# EAGLE design main_v2.0 (EAGLE 7.2.0)
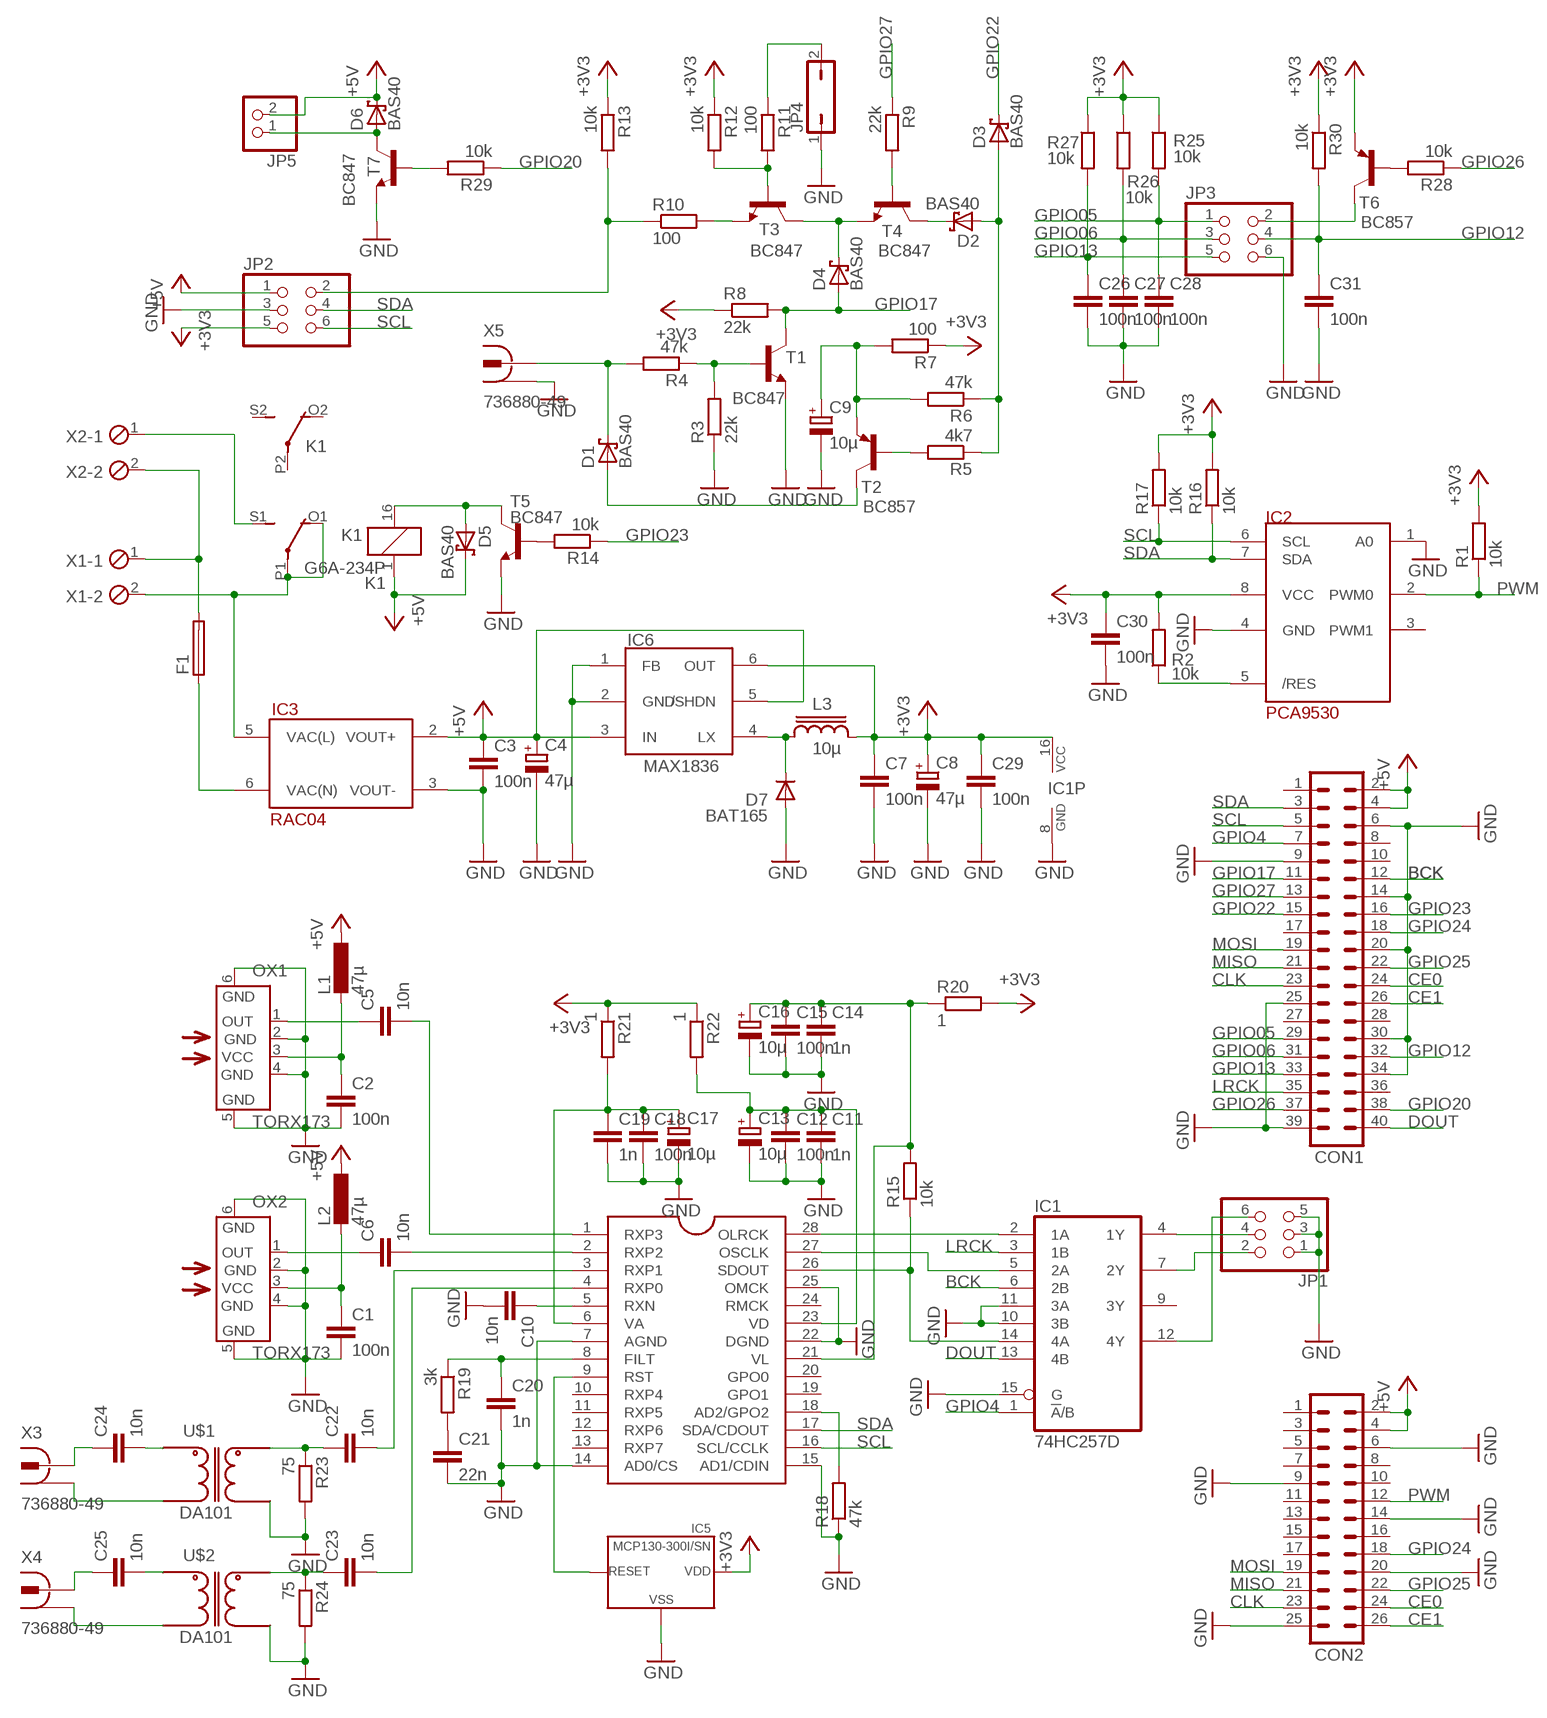
[diagram p0: schematic, sheet 1]

## Parts
C1  100n  C-EUC0805  [C0805]
C2  100n  C-EUC0805  [C0805]
C3  100n  C-EUC0805  [C0805]
C4  47µ  CPOL-EUCT3528  [CT3528]
C5  10n  C-EUC0805  [C0805]
C6  10n  C-EUC0805  [C0805]
C7  100n  C-EUC0805  [C0805]
C8  47µ  CPOL-EUCT3528  [CT3528]
C9  10µ  CPOL-EUCT3216  [CT3216]
C10  10n  C-EUC0805  [C0805]
C11  1n  C-EUC0805  [C0805]
C12  100n  C-EUC0805  [C0805]
C13  10µ  CPOL-EUCT3216  [CT3216]
C14  1n  C-EUC0805  [C0805]
C15  100n  C-EUC0805  [C0805]
C16  10µ  CPOL-EUCT3216  [CT3216]
C17  10µ  CPOL-EUCT3216  [CT3216]
C18  100n  C-EUC0805  [C0805]
C19  1n  C-EUC0805  [C0805]
C20  1n  C-EUC0805  [C0805]
C21  22n  C-EUC0805  [C0805]
C22  10n  C-EUC0805  [C0805]
C23  10n  C-EUC0805  [C0805]
C24  10n  C-EUC0805  [C0805]
C25  10n  C-EUC0805  [C0805]
C26  100n  C-EUC0805  [C0805]
C27  100n  C-EUC0805  [C0805]
C28  100n  C-EUC0805  [C0805]
C29  100n  C-EUC0805  [C0805]
C30  100n  C-EUC0805  [C0805]
C31  100n  C-EUC0805  [C0805]
CON1  MA20-2  [MA20-2]
CON2  MA13-2  [MA13-2]
D1  BAS40  [SOT23]
D2  BAS40  [SOT23]
D3  BAS40  [SOT23]
D4  BAS40  [SOT23]
D5  BAS40  [SOT23]
D6  BAS40  [SOT23]
D7  BAT165  DIODE-SOD-323  [SOD-323F]
F1  19560  [19560]
IC1  74HC257D  [SO16]
IC2  PCA9530  [SOIC-8]
IC3  RAC04  [RECOM-RAC04]
IC4  CS8416  CS8416-SOFTWAREMODESOFTWAREMODE  [SO28L]
IC5  MCP130-300I/SN  [SOT-23]
IC6  MAX1836  MAX1836SOT23  [SOT23-6L]
JP1  PINHD-2X3  [2X03]
JP2  PINHD-2X3  [2X03]
JP3  PINHD-2X3  [2X03]
JP4  JP1Q  [JP1]
JP5  PINHD-1X2  [1X02]
K1  G6A-234P  [G6A-234P]
L1  47µ  L-EU  [C1210]
L2  47µ  L-EU  [C1210]
L3  10µ  LPS4018  [LPS4018]
OX1  TORX173  [TORX173]
OX2  TORX173  [TORX173]
R1  10k  R-EU_R0805  [R0805]
R2  10k  R-EU_R0805  [R0805]
R3  22k  R-EU_R0805  [R0805]
R4  47k  R-EU_R0805  [R0805]
R5  4k7  R-EU_R0805  [R0805]
R6  47k  R-EU_R0805  [R0805]
R7  100  R-EU_R0805  [R0805]
R8  22k  R-EU_R0805  [R0805]
R9  22k  R-EU_R0805  [R0805]
R10  100  R-EU_R0805  [R0805]
R11  100  R-EU_R0805  [R0805]
R12  10k  R-EU_R0805  [R0805]
R13  10k  R-EU_R0805  [R0805]
R14  10k  R-EU_R0805  [R0805]
R15  10k  R-EU_R0805  [R0805]
R16  10k  R-EU_R0805  [R0805]
R17  10k  R-EU_R0805  [R0805]
R18  47k  R-EU_R0805  [R0805]
R19  3k  R-EU_R0805  [R0805]
R20  1  R-EU_R0805  [R0805]
R21  1  R-EU_R0805  [R0805]
R22  1  R-EU_R0805  [R0805]
R23  75  R-EU_R0805  [R0805]
R24  75  R-EU_R0805  [R0805]
R25  10k  R-EU_R0805  [R0805]
R26  10k  R-EU_R0805  [R0805]
R27  10k  R-EU_R0805  [R0805]
R28  10k  R-EU_R0805  [R0805]
R29  10k  R-EU_R0805  [R0805]
R30  10k  R-EU_R0805  [R0805]
T1  BC847  BC847-NPN-SOT23-BEC  [SOT23-BEC]
T2  BC857  BC857A-PNP-SOT23-BEC  [SOT23-BEC]
T3  BC847  BC847-NPN-SOT23-BEC  [SOT23-BEC]
T4  BC847  BC847-NPN-SOT23-BEC  [SOT23-BEC]
T5  BC847  BC847-NPN-SOT23-BEC  [SOT23-BEC]
T6  BC857  BC857A-PNP-SOT23-BEC  [SOT23-BEC]
T7  BC847  BC847-NPN-SOT23-BEC  [SOT23-BEC]
U$1  DA101  [6PIN-DIL]
U$2  DA101  [6PIN-DIL]
X1  2POL500  [2POL500]
X2  2POL500  [2POL500]
X3  736880-49  [736880-49]
X4  736880-49  [736880-49]
X5  736880-49  [736880-49]

## Nets
+3V3: C7.1 C8.+ C29.1 C30.1 IC1.16(VCC) IC2.8(VCC) IC5.2(VDD) IC6.6(OUT) JP2.5 L3.2 R1.2 R2.2 R7.1 R8.1 R12.1 R13.1 R16.2 R17.2 R20.2 R21.1 R22.1 R25.1 R26.1 R27.1 R30.1 T6.E
+5V: C3.1 C4.+ CON1.2 CON1.4 CON2.2 CON2.4 D5.3(C) D6.3(C) IC3.2(VOUT+) IC6.3(IN) IC6.5(/SHDN) JP2.1 JP5.2 K1.1 L1.1 L2.1
BCK: CON1.12 IC1.6(2B)
CE0: CON1.24 CON2.24
CE1: CON1.26 CON2.26
CLK: CON1.23 CON2.23
DOUT: CON1.40 IC1.13(4B)
GND: C1.2 C2.2 C3.2 C4.- C7.2 C8.- C9.- C10.2 C11.2 C12.2 C13.- C14.2 C15.2 C16.- C17.- C18.2 C19.2 C20.2 C21.2 C26.2 C27.2 C28.2 C29.2 C30.2 C31.2 CON1.6 CON1.9 CON1.14 CON1.20 CON1.25 CON1.30 CON1.34 CON1.39 CON2.6 CON2.9 CON2.14 CON2.20 CON2.25 D7.A IC1.8(GND) IC1.10(3B) IC1.11(3A) IC1.15(G) IC2.1(A0) IC2.4(GND) IC3.3(VOUT-) IC4.7(AGND) IC4.14(AD0/CS) IC4.15(AD1/CDIN) IC4.22(DGND) IC4.25(OMCK) IC5.3(VSS) IC6.1(FB) IC6.2(GND) JP1.1 JP1.3 JP1.5 JP2.3 JP3.6 JP4.1 OX1.2(GND) OX1.4(GND) OX1.5(GND) OX1.6(GND) OX2.2(GND) OX2.4(GND) OX2.5(GND) OX2.6(GND) R3.1 R18.1 R23.2 R24.2 T1.E T5.E T7.E U$1.4 U$2.4 X5.1 X5.1@1 X5.1@2
GPIO4: CON1.7 IC1.1(!A!/B)
GPIO05: C28.1 CON1.29 JP3.1 R25.2
GPIO06: C27.1 CON1.31 JP3.3 R26.2
GPIO12: C31.1 CON1.32 JP3.4 R30.2
GPIO13: C26.1 CON1.33 JP3.5 R27.2
GPIO17: CON1.11 D4.1(A) R8.2 T1.C
GPIO20: CON1.38 R29.1
GPIO22: CON1.15 D3.3(C)
GPIO23: CON1.16 R14.1
GPIO24: CON1.18 CON2.18
GPIO25: CON1.22 CON2.22
GPIO26: CON1.37 R28.1
GPIO27: CON1.13 R9.1
LRCK: CON1.35 IC1.3(1B)
MISO: CON1.21 CON2.21
MOSI: CON1.19 CON2.19
N$1: C11.1 C12.1 C13.+ IC4.23(VD) R22.2
N$2: IC1.2(1A) IC4.28(OLRCK)
N$3: IC1.5(2A) IC4.27(OSCLK)
N$4: IC1.14(4A) IC4.26(SDOUT) R15.1
N$5: IC4.9(RST) IC5.1(RESET)
N$6: IC2.5(/RES) R2.1
N$7: F1.1 IC3.6(VAC(N))
N$8: C17.+ C18.1 C19.1 IC4.6(VA) R21.2
N$9: C6.1 OX2.1(OUT)
N$10: C5.1 OX1.1(OUT)
N$11: C6.2 IC4.2(RXP2)
N$12: C5.2 IC4.1(RXP3)
N$13: IC3.5(VAC(L)) K1.O1(2:O) K1.P1(2:P) X1.2
N$14: R3.2 R4.1 T1.B
N$15: JP4.2 R11.1
N$16: D1.1(A) T2.C
N$17: D1.3(C) R4.2 X5.2
N$18: C9.+ R6.2 R7.2 T2.E
N$19: R5.2 T2.B
N$20: D2.1(A) D3.1(A) R5.1 R6.1
N$21: D4.3(C) T3.C T4.E
N$22: R10.2 T3.E
N$23: R11.2 R12.2 T3.B
N$24: R9.2 T4.B
N$25: D2.3(C) T4.C
N$26: IC1.7(2Y) JP1.2
N$27: IC1.4(1Y) JP1.4
N$28: D7.C IC6.4(LX) L3.1
N$29: JP2.2 R10.1 R13.2
N$30: C10.1 IC4.5(RXN)
N$31: IC4.18(AD2/GPO2) R18.2
N$32: C14.1 C15.1 C16.+ IC4.21(VL) R15.2 R20.1
N$33: D5.1(A) K1.16 T5.C
N$34: R14.2 T5.B
N$35: C22.1 R23.1 U$1.6
N$36: C20.1 IC4.8(FILT) R19.1
N$37: C21.1 R19.2
N$38: C22.2 IC4.3(RXP1)
N$39: C23.2 IC4.4(RXP0)
N$40: C23.1 R24.1 U$2.6
N$41: C24.2 U$1.1
N$42: U$1.3 X3.1 X3.1@1 X3.1@2
N$43: C24.1 X3.2
N$44: C25.2 U$2.1
N$45: U$2.3 X4.1 X4.1@1 X4.1@2
N$46: C25.1 X4.2
N$47: R28.2 T6.B
N$48: K1.S1(2:S) X2.1
N$49: F1.2 X1.1 X2.2
N$50: C2.1 L1.2 OX1.3(VCC)
N$51: C1.1 L2.2 OX2.3(VCC)
N$52: D6.1(A) JP5.1 T7.C
N$53: IC1.12(4Y) JP1.6
N$54: JP3.2 T6.C
N$55: R29.2 T7.B
PWM: CON2.12 IC2.2(PWM0) R1.1
SCL: CON1.5 IC2.6(SCL) IC4.16(SCL/CCLK) JP2.6 R17.1
SDA: CON1.3 IC2.7(SDA) IC4.17(SDA/CDOUT) JP2.4 R16.1
Unconnected: CON1.1 CON1.8 CON1.10 CON1.17 CON1.27 CON1.28 CON1.36 CON2.1 CON2.3 CON2.5 CON2.7 CON2.8 CON2.10 CON2.11 CON2.13 CON2.15 CON2.16 CON2.17 IC1.9(3Y) IC2.3(PWM1) IC4.10(RXP4) IC4.11(RXP5) IC4.12(RXP6) IC4.13(RXP7) IC4.19(GPO1) IC4.20(GPO0) IC4.24(RMCK) K1.O2(3:O) K1.P2(3:P) K1.S2(3:S)

## Library data of the parts
C1-C3 C5-C7 C10-C12 C14 C15 C18-C31 = rcl:C-EU: CAPACITOR, European symbol
C4 C8 C9 C13 C16 C17 = rcl:CPOL-EU: POLARIZED CAPACITOR, European symbol
CON1 = con-lstb:MA20-2: PIN HEADER; OC_FARNELL: unknown; OC_NEWARK: unknown
CON2 = con-lstb:MA13-2: PIN HEADER; OC_FARNELL: unknown; OC_NEWARK: unknown
D1-D6 = diode:BAS40: Silicon Schottky Diodes General-purpose diode for high-speed switching
D7 = dp_devices:DIODE: Various Diode Packages
F1 = fuse:19560: FUSE HOLDER TR5, Wickmann; MPN: 56000001009; OC_FARNELL: 1185363; OC_NEWARK: 15P8392
IC1 = 74xx-eu:74*257: Quadruple 2-to 1 line data SELECTOR/MULTIPLEXER
IC2 = user:PCA9530
IC3 = user:RAC04
IC4 = cirrus-dar:CS8416-SOFTWAREMODE: 24bit 192kHz Digital Audio Interface Receiver - Software Mode
IC5 = microchip_mcp130:MCP130
IC6 = maxim-5:MAX1836
JP1-JP3 = pinhead:PINHD-2X3: PIN HEADER
JP4 = jumper:JP1Q: JUMPER
JP5 = pinhead:PINHD-1X2: PIN HEADER
K1 = relay:G6A-234P: RELAY 2 x switch, 0.3 A/125 V AC, 1 A/30 V DC, Omron; OC_FARNELL: unknown; OC_NEWARK: unknown
L1 L2 = user:L-EU: INDUCTOR, European symbol
L3 = inductor-coilcraft:LPS4018: POWER INDUCTOR
OX1 OX2 = toshiba:TORX173: FIBER OPTIC RECEIVING MODULE FOR DIGITAL AUDIO EQUIPMENT, TTL Interface TORX173.pdf; OC_FARNELL: unknown; OC_NEWARK: unknown
R1-R30 = rcl:R-EU_: RESISTOR, European symbol
T1 T3-T5 T7 = transistor:*-NPN-: NPN Transistror BF959 corrected 2008.03.06
T2 T6 = transistor:*-PNP-: PNP Transistror
U$1 U$2 = user:DA101
X1 X2 = user:2POL500: PHOENIX CONNECTOR; OC_FARNELL: unknown; OC_NEWARK: unknown
X3-X5 = con-conrad:736880-49: Cinch Connector ( RCA Jack ) Cinch-Einbaukupplung 90º 72345 Vernickelt BKL Electronic Source: Conrad <http://www.conrad.de/ce/de/product/736880>

## Board
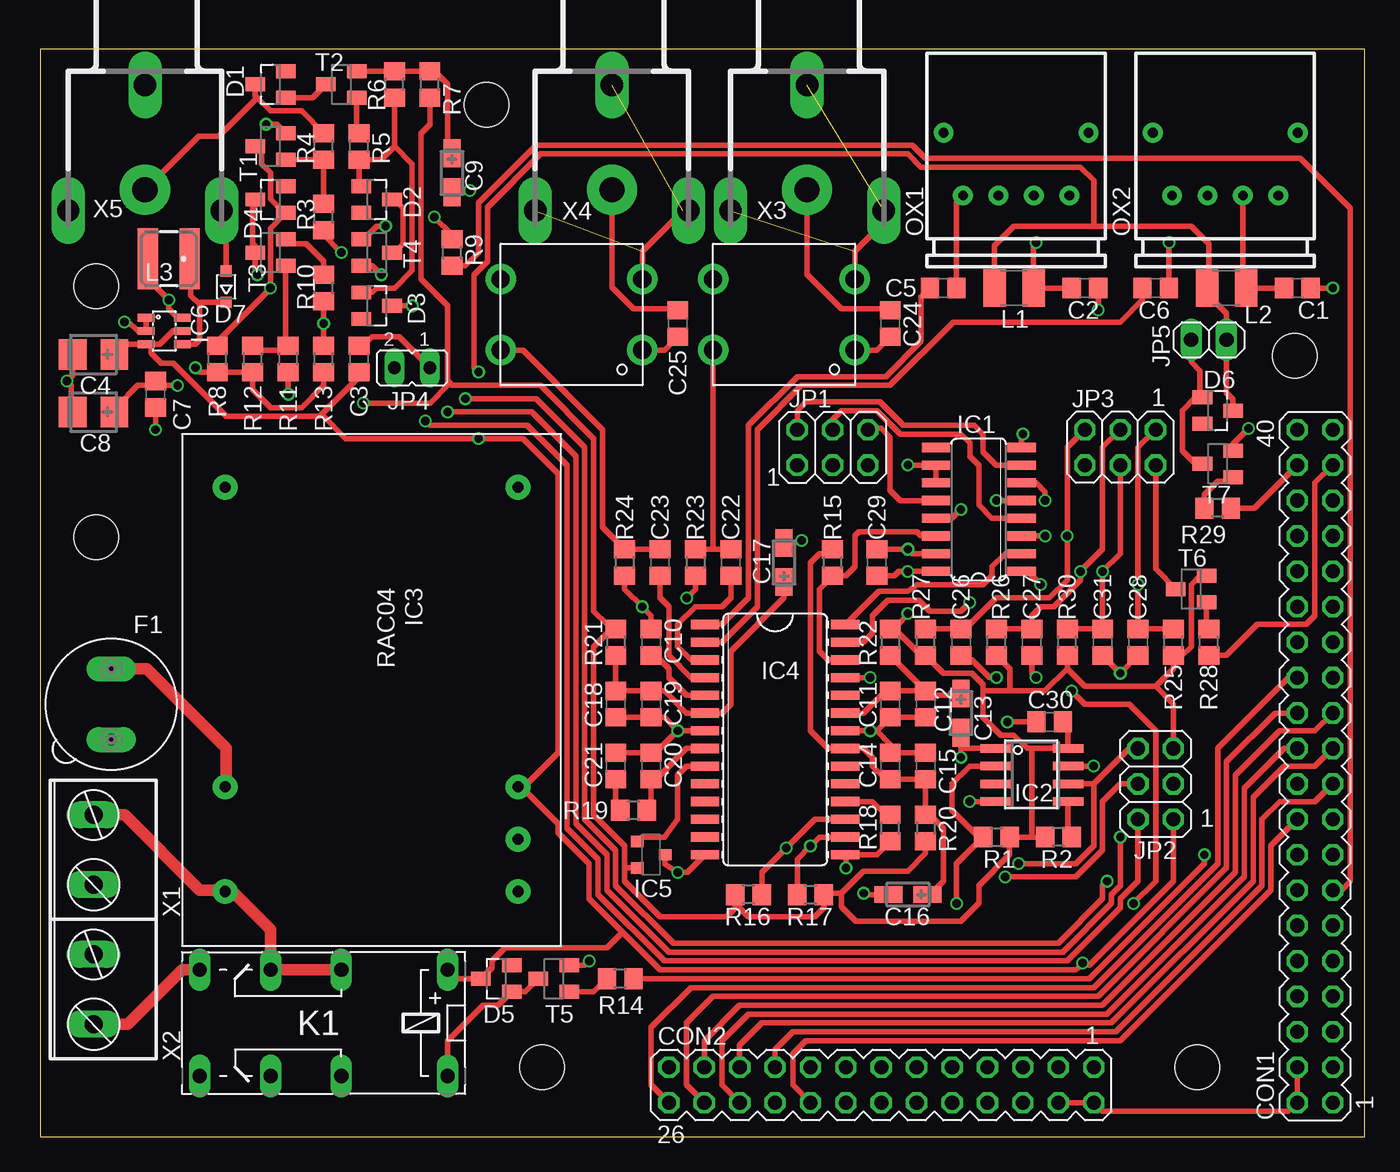
[diagram p1: board, top side]
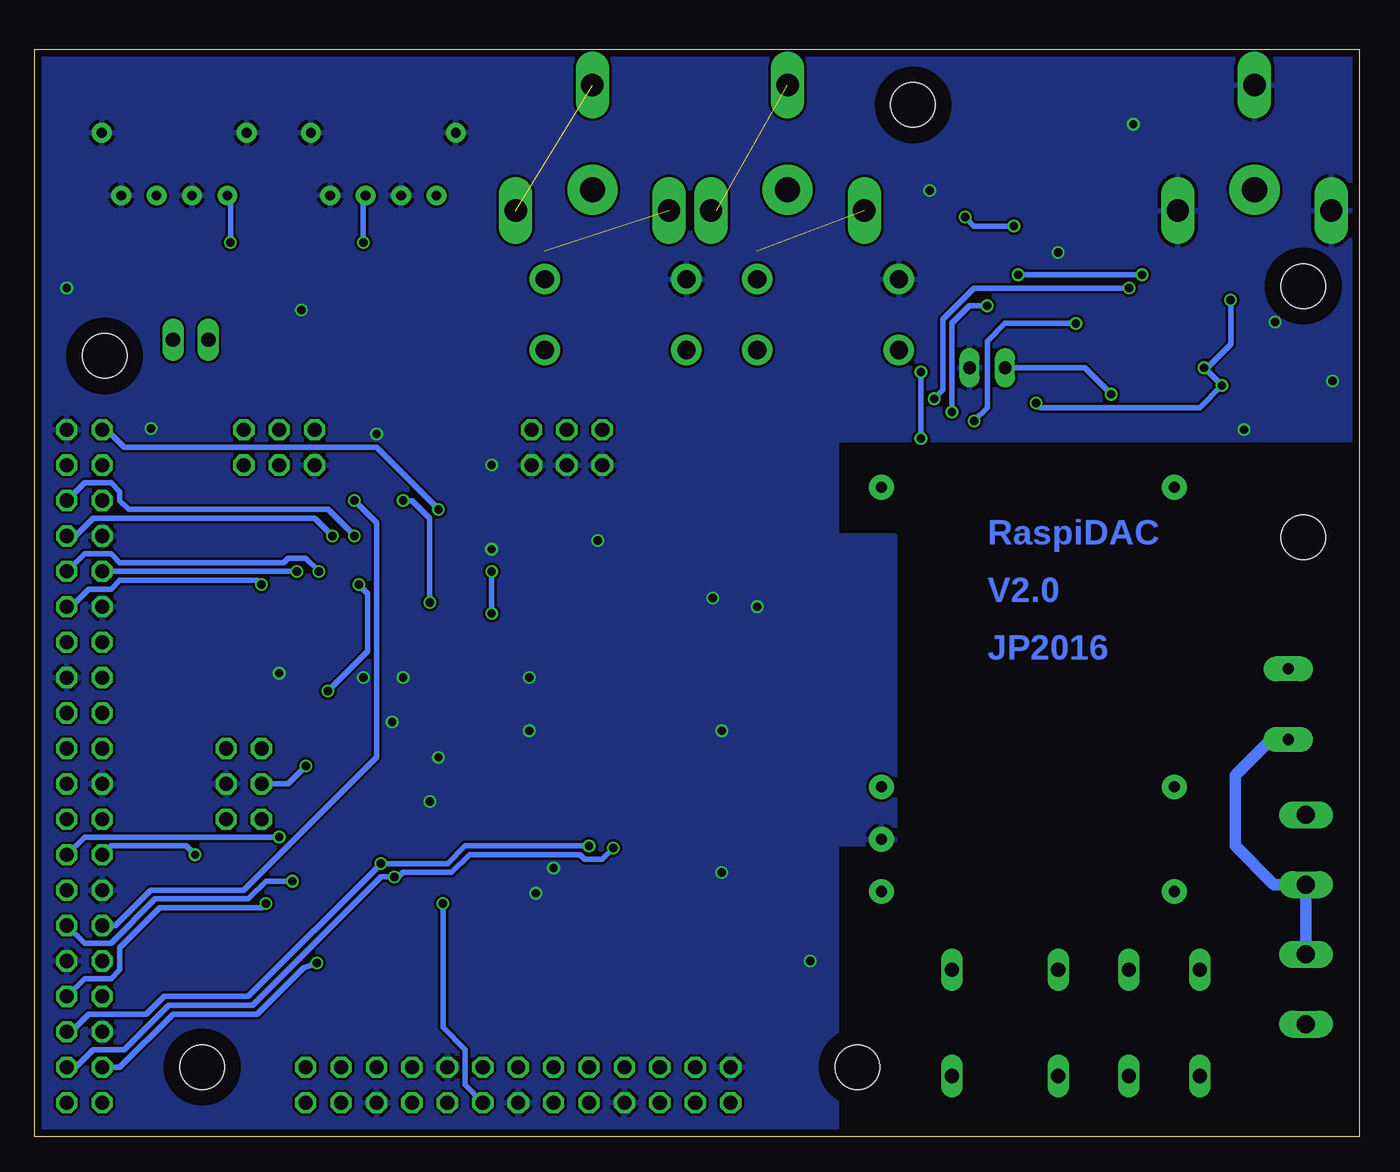
[diagram p2: board, bottom side, seen from below]

Size 95 x 78 mm. Coordinates in mm from the lower left corner, seen from the top.
Outline: 0,0 95,0 95,78 0,78 0,0
Copper layers (1*16): Top 0.035mm / dielectric 1.5mm / Bottom 0.035mm
Design rules "EagleRules *": minimum track width 7mil, minimum drill 12mil, track to track 7mil, track to pad 7mil, pad to pad 7mil, via to via 7mil, smd to smd 0mil, copper to edge 20mil, drill to drill 10mil, minimum pad ring 10mil, minimum via ring 6mil, stop-mask expansion 2mil, vias tented up to drill 25mil, thermal gap 10mil
Holes 3.2 mm at 36,5 32,74 90,56 83,5 4,61 4,43
bRestrict: area 29.2,71.2 to 34.8,76.8; area 87.2,53.2 to 92.8,58.8; area 80.2,2.2 to 85.8,7.8; area 33.2,2.2 to 38.8,7.8; area 1.2,58.2 to 6.8,63.8; area 1.2,40.2 to 6.8,45.8

### Footprints (pad centres in the part's own frame; a part is rotated, then mirrored left to right if it is on the bottom)
C0805 = smd 1.3 x 1.5: 1 -0.95,0; 2 0.95,0
CT3528 = smd 2 x 2.2: + -1.5,0; - 1.5,0
CT3216 = smd 2 x 1.2: + -1.4,0; - 1.4,0
MA20-2 = drill 1.016 octagon: 1 -24.13,-1.27; 2 -24.13,1.27; 3 -21.59,-1.27; 4 -21.59,1.27; 5 -19.05,-1.27; 6 -19.05,1.27; 7 -16.51,-1.27; 8 -16.51,1.27; 9 -13.97,-1.27; 10 -13.97,1.27; 11 -11.43,-1.27; 12 -11.43,1.27; 13 -8.89,-1.27; 14 -8.89,1.27; 15 -6.35,-1.27; 16 -6.35,1.27; 17 -3.81,-1.27; 18 -3.81,1.27; 19 -1.27,-1.27; 20 -1.27,1.27; 21 1.27,-1.27; 22 1.27,1.27; 23 3.81,-1.27; 24 3.81,1.27; 25 6.35,-1.27; 26 6.35,1.27; 27 8.89,-1.27; 28 8.89,1.27; 29 11.43,-1.27; 30 11.43,1.27; 31 13.97,-1.27; 32 13.97,1.27; 33 16.51,-1.27; 34 16.51,1.27; 35 19.05,-1.27; 36 19.05,1.27; 37 21.59,-1.27; 38 21.59,1.27; 39 24.13,-1.27; 40 24.13,1.27
MA13-2 = drill 1.016 octagon: 1 -15.24,-1.27; 2 -15.24,1.27; 3 -12.7,-1.27; 4 -12.7,1.27; 5 -10.16,-1.27; 6 -10.16,1.27; 7 -7.62,-1.27; 8 -7.62,1.27; 9 -5.08,-1.27; 10 -5.08,1.27; 11 -2.54,-1.27; 12 -2.54,1.27; 13 0,-1.27; 14 0,1.27; 15 2.54,-1.27; 16 2.54,1.27; 17 5.08,-1.27; 18 5.08,1.27; 19 7.62,-1.27; 20 7.62,1.27; 21 10.16,-1.27; 22 10.16,1.27; 23 12.7,-1.27; 24 12.7,1.27; 25 15.24,-1.27; 26 15.24,1.27
SOT23 = smd 1 x 1.4: 1 -0.95,-1.1; 2 0.95,-1.1; 3 0,1.1
SOD-323F = smd 0.8 x 0.8: A 1.125,0; C -1.125,0
19560 = drill 0.813 pad 1.778 long: 1 -2.54,0; 2 2.54,0
SO16 = smd 0.66 x 2.032: 1 -4.445,-3.073; 2 -3.175,-3.073; 3 -1.905,-3.073; 4 -0.635,-3.073; 5 0.635,-3.073; 6 1.905,-3.073; 7 3.175,-3.073; 8 4.445,-3.073; 9 4.445,3.073; 10 3.175,3.073; 11 1.905,3.073; 12 0.635,3.073; 13 -0.635,3.073; 14 -1.905,3.073; 15 -3.175,3.073; 16 -4.445,3.073
SOIC-8 = smd 0.6 x 2.2: 1 -1.905,-2.6; 2 -0.635,-2.6; 3 0.635,-2.6; 4 1.905,-2.6; 5 1.905,2.6; 6 0.635,2.6; 7 -0.635,2.6; 8 -1.905,2.6
RECOM-RAC04 = drill 0.8 pad 1.778: 1 3.8,24.1; 2 25.3,24.1; 3 29.05,24.1; 4 32.8,24.1; 5 32.8,3.1; 6 25.3,3.1; 7 3.8,3.1
SO28L = smd 0.66 x 2.032: 1 -8.255,-5.029; 2 -6.985,-5.029; 3 -5.715,-5.029; 4 -4.445,-5.029; 5 -3.175,-5.029; 6 -1.905,-5.029; 7 -0.635,-5.029; 8 0.635,-5.029; 9 1.905,-5.029; 10 3.175,-5.029; 11 4.445,-5.029; 12 5.715,-5.029; 13 6.985,-5.029; 14 8.255,-5.029; 15 8.255,5.029; 16 6.985,5.029; 17 5.715,5.029; 18 4.445,5.029; 19 3.175,5.029; 20 1.905,5.029; 21 0.635,5.029; 22 -0.635,5.029; 23 -1.905,5.029; 24 -3.175,5.029; 25 -4.445,5.029; 26 -5.715,5.029; 27 -6.985,5.029; 28 -8.255,5.029
SOT-23 = smd 0.8 x 0.9: 1 -0.95,-1; 2 0.95,-1; 3 0,1
SOT23-6L = smd 0.55 x 1.2: 1 -0.95,-1.3; 2 0,-1.3; 3 0.95,-1.3; 4 0.95,1.3; 5 0,1.3; 6 -0.95,1.3
2X03 = drill 1.016 octagon: 1 -2.54,-1.27; 2 -2.54,1.27; 3 0,-1.27; 4 0,1.27; 5 2.54,-1.27; 6 2.54,1.27
JP1 = drill 0.914 long: 1 0,-1.27; 2 0,1.27
1X02 = drill 1.016 long: 1 -1.27,0; 2 1.27,0
G6A-234P = drill 1.016 long: 1 -3.81,-3.81; 16 -3.81,3.81; O1 8.89,-3.81; O2 8.89,3.81; P1 3.81,-3.81; P2 3.81,3.81; S1 13.97,-3.81; S2 13.97,3.81
C1210 = smd 1.6 x 2.7: 1 -1.4,0; 2 1.4,0
LPS4018 = smd 1.45 x 4.4: 1 -1.5,0; 2 1.5,0
TORX173 = drill 0.7 pad 1.422: 1 -3.81,0; 2 -1.27,0; 3 1.27,0; 4 3.81,0; 5 5.2,4.5; 6 -5.2,4.5
R0805 = smd 1.3 x 1.5: 1 -0.95,0; 2 0.95,0
SOT23-BEC = smd 1 x 1.4: B -0.95,-1.1; C 0,1.1; E 0.95,-1.1
6PIN-DIL = drill 1.3 pad 2.184: 1 -5.08,2.54; 3 -5.08,-2.54; 4 5.08,-2.54; 6 5.08,2.54
2POL500 = drill 1.3 long: 1 -2.5,0; 2 2.5,0
736880-49 = drill 1.6 pad 2 long: 1 -3.92,0; 1@1 5.08,-5.5; 1@2 5.08,5.5 | drill 1.8 pad 3.6: 2 3.58,0

### Placement (x,y rotation side)
C1  90.17,60.87 0 top
C2  74.93,60.87 0 top
C3  22.86,55.78 90 top
C4  3.81,56.1 180 top
C5  64.77,60.87 180 top
C6  80.01,60.87 180 top
C7  8.26,53.24 270 top
C8  3.81,51.98 180 top
C9  29.53,69.12 270 top
C10  43.81,35.47 90 top
C11  60.96,31.02 270 top
C12  63.5,31.02 270 top
C13  66.04,30.39 270 top
C14  60.96,26.57 90 top
C15  63.5,26.57 90 top
C16  62.23,17.37 180 top
C17  53.34,41.18 90 top
C18  41.27,31.02 270 top
C19  43.81,31.02 270 top
C20  43.81,26.57 90 top
C21  41.27,26.57 90 top
C22  49.53,41.18 270 top
C23  44.45,41.18 270 top
C24  60.96,58.33 270 top
C25  45.72,58.33 270 top
C26  66.04,35.47 270 top
C27  71.12,35.47 270 top
C28  78.74,35.47 270 top
C29  60.01,41.18 90 top
C30  72.39,29.75 180 top
C31  76.2,35.47 270 top
CON1  91.44,26.57 90 top
CON2  60.33,3.71 180 top
D1  16.51,75.47 90 top
D2  24.13,67.22 270 top
D3  24.13,59.59 270 top
D4  16.51,67.22 90 top
D5  32.7,11.34 90 top
D6  84.45,52.07 270 top
D7  13.34,60.96 90 top
F1  5.08,31.02 270 top
IC1  67.31,44.99 90 top
IC2  71.12,25.94 270 top
IC3  10.16,50.39 270 top
IC4  52.7,28.48 270 top
IC5  43.81,20.23 270 top
IC6  8.89,57.78 270 top
JP1  56.83,49.44 0 top
JP2  80.01,25.3 90 top
JP3  77.47,49.44 180 top
JP4  26.67,55.15 90 top
JP5  83.82,57.15 0 top
K1  25.4,8.16 180 top
L1  69.85,60.87 0 top
L2  85.09,60.87 0 top
L3  9.21,62.96 180 top
OX1  70,67.5 0 top
OX2  85,67.5 0 top
R1  68.58,21.5 0 top
R2  73.03,21.5 180 top
R3  20.32,65.94 90 top
R4  20.32,71.03 90 top
R5  22.86,71.03 90 top
R6  25.4,75.47 90 top
R7  27.94,75.47 90 top
R8  12.7,55.78 90 top
R9  29.53,63.41 90 top
R10  20.32,60.87 90 top
R11  17.78,55.78 90 top
R12  15.24,55.78 90 top
R13  20.32,55.78 90 top
R14  41.59,11.34 180 top
R15  56.83,41.18 90 top
R16  50.8,17.37 180 top
R17  55.24,17.37 0 top
R18  60.96,22.13 90 top
R19  42.55,23.4 180 top
R20  63.5,22.13 270 top
R21  41.27,35.47 270 top
R22  60.96,35.47 270 top
R23  46.99,41.18 270 top
R24  41.91,41.18 270 top
R25  81.28,35.47 90 top
R26  68.58,35.47 90 top
R27  63.5,35.47 90 top
R28  83.82,35.47 90 top
R29  84.45,45.09 180 top
R30  73.66,35.47 90 top
T1  16.51,71.03 90 top
T2  21.59,75.47 90 top
T3  16.51,63.41 90 top
T4  24.13,63.41 270 top
T5  36.83,11.34 90 top
T6  82.55,39.27 90 top
T7  84.45,48.26 90 top
U$1  53.34,58.96 180 top
U$2  38.1,58.96 180 top
X1  3.81,20.58 90 top
X2  3.81,10.58 90 top
X3  55,71.5 270 top
X4  41,71.5 270 top
X5  7.5,71.5 270 top

### Tracks (layer width: path | path; a pad name or v marks a point on that pad's centre or on a via)
+3V3  (via drill 0.6)
  Top 0.406: 71.12,27.84 IC2.8 73.72,29.69 C30.1 | 71.12,27.84 71.12,21.5 | 71.12,21.5 R2.2 | 71.12,21.5 R1.2 69.53,20.22 67.31,18 67.31,16.73 66.04,15.46 58.52,15.46 57.47,16.51 57.47,17.46 | R13.1 20.32,53.88 18.73,52.29 16.51,52.29 15.24,53.56 R12.1 R8.1 11.43,54.83 v11.11,55.15 | 29.21,54.2 29.21,53.88 27.94,52.61 v23.18,52.61 | 29.21,54.2 29.21,59.59 27.3,61.5 27.3,71.98 27.94,72.61 R7.1 | C8.+ 6.35,53.24 6.99,53.88 7.94,53.88 C7.1 8.57,54.2 8.89,53.88 v9.84,53.88 | v62.23,37.53 61.59,36.73 61.28,36.73 R22.1 61.27,36.1 61.59,36.1 63.18,34.52 R27.1 64.77,33.24 66.83,33.24 67.63,32.45 67.63,31.97 | 80.01,32.29 81.28,33.56 R25.1 81.92,34.52 82.55,35.15 82.55,39.59 83.19,40.23 T6.E | 80.01,32.29 74.93,32.29 73.66,33.56 | 73.66,33.56 72.07,31.97 69.37,31.97 | 69.37,31.97 67.63,31.97 | 71.12,27.84 70.8,27.84 69.85,28.8 68.9,28.8 67.63,30.07 67.63,31.97 | 69.37,31.97 69.53,32.13 69.53,33.56 R26.1 | 41.91,19.27 41.91,20.86 39.69,23.08 39.69,35.15 40.64,36.1 40.96,36.1 R21.1 40.95,36.73 40.64,36.73 39.69,37.69 39.69,50.07 35.88,53.88 29.53,53.88 29.21,54.2 | 41.91,19.27 41.91,18.32 44.45,15.78 49.21,15.78 49.85,16.42 | IC5.2 41.91,19.27 | R16.2 49.85,16.42 | R17.2 56.2,16.41 55.56,15.78 50.8,15.78 50.16,16.42 49.85,16.42 | JP2.5 81.28,31.02 80.01,32.29 | IC1.16 v62.23,40.55 61.59,40.55 61.28,40.23 C29.1 | R30.1 73.66,33.56 | R20.2 63.5,20.32 62.23,19.05 59.05,19.05 57.47,17.46 | R17.2 | 57.47,17.46 56.29,17.46 R17.2 | IC6.6 10.51,58.74 9.84,58.74 9.21,59.37 v9.21,60.01 7.94,61.28 7.94,62.73 L3.2
  Bottom 0.406: v23.18,52.61 22.86,52.29 11.43,52.29 v9.84,53.88 v11.11,55.15 11.11,55.24 10.79,55.24 9.21,56.83 v9.21,60.01 | v62.23,37.53 v62.23,40.55
+5V  (via drill 0.6)
  Top 0.406: CON2.4 CON2.2 76.2,1.81 89.53,1.81 CON1.2 CON1.4 | C3.1 22.86,54.52 20.16,51.82 | 20.16,51.82 20,51.66 13.34,51.66 9.53,55.47 8.67,55.47 7.94,56.2 7.94,56.8 IC6.3 | 75.56,65.31 69.85,65.31 68.45,63.91 L1.1 | 75.56,65.31 82.55,65.31 83.82,64.04 83.82,62.27 L2.1 83.69,60.45 85.09,59.05 JP5.2 85.09,53.34 85.56,52.88 D6.3 | K1.1 29.84,11.34 D5.3 32.38,12.12 32.38,12.61 33.34,13.56 40.64,13.56 41.75,14.67 | 20.16,51.82 21.91,50.07 v31.43,50.07 34.61,50.07 37.15,47.53 37.15,27.53 34.71,25.09 IC3.2 34.68,24.67 34.92,24.67 37.15,22.45 37.15,21.81 39.37,19.59 39.37,17.05 41.75,14.67 | 74.93,12.29 v74.77,12.45 | v31.43,54.83 31.11,55.15 31.11,61.82 32.07,62.77 32.07,66.67 35.88,70.48 62.23,70.48 63.18,69.53 74.61,69.53 75.56,68.58 75.56,65.31 | 41.75,14.67 44.45,11.97 74.3,11.97 74.46,12.13 v74.77,12.45 | JP2.1 81.28,18.32 75.56,12.61 75.24,12.29 v74.77,12.45 | 7.91,56.83 IC6.3 | IC6.5 9.53,57.78 8.57,56.83 IC6.3 | IC6.3 6.04,56.84 C4.+
  Bottom 0.406: CON1.4 88.9,4.99 85.09,8.79 79.06,8.79 75.72,12.13 v74.77,12.45 | v31.43,54.83 v31.43,50.07
BCK  (via drill 0.6)
  Top 0.406: v72.07,45.62 72.07,46.26 71.44,46.9 IC1.6
  Bottom 0.406: v72.07,45.62 70.48,44.04 70.48,27.21 80.01,17.68 86.68,17.68 89.22,15.14 CON1.12
CE0
  Top 0.406: CON2.24 46.35,3.71 46.35,8.16 48.26,10.06 75.88,10.06 85.09,19.27 85.09,26.89 88.58,30.39 CON1.24
CE1
  Top 0.406: CON2.26 43.81,3.71 43.81,7.84 46.67,10.7 75.56,10.7 84.45,19.59 84.45,27.84 89.53,32.92 CON1.26
CLK
  Top 0.406: CON2.23 47.62,6.89 50.16,9.43 76.2,9.43 85.72,18.95 85.72,25.94 88.9,29.11 91.44,29.11 CON1.23
DOUT  (via drill 0.6)
  Top 0.406: IC1.13 65.41,44.35 v66.04,44.99
  Bottom 0.406: CON1.40 89.85,50.7 88.58,49.44 70.48,49.44 v66.04,44.99
GND  (via drill 0.6)
  Top 0.406: IC4.14 46.41,18.95 v45.72,18.95 44.81,19.54 IC5.3 | 47.62,29.11 IC4.7 v45.72,29.11 | C21.2 C20.2 44.13,27.52 v45.72,29.11 | C10.2 43.81,37.37 v43.18,38.01 41.91,39.27 R24.2 | R23.2 46.99,39.27 v46.35,38.64 | R3.1 20.32,64.67 v21.59,63.41 | IC4.22 v59.52,29.11 60.01,29.11 | 60.01,29.11 C11.2 C12.2 | 60.01,29.11 60.96,28.16 C14.2 C15.2 | 60.01,20.23 IC4.15 57.78,20.17 v57.78,19.27 | 60.01,20.23 R18.1 | IC2.4 v66.67,24.04 | IC4.25 v59.53,32.92 | C2.2 75.88,60.55 v75.88,59.28 | C1.2 v92.71,60.87 | v16.19,72.61 16.97,72.61 T1.E | IC1.11 IC1.10 v62.23,48.16 | JP4.1 25.72,57.37 23.81,57.37 23.18,56.73 C3.2 | C4.- 2.31,54.6 v1.91,54.2 2.22,53.88 2.22,53.33 C8.- | C7.2 v8.26,50.7 | 60.01,20.22 60.01,20.23 | C13.- 66.04,27.84 | 66.04,27.84 v66.04,27.21 | v45.72,29.11 44.77,30.07 C19.2 C18.2 | C9.- 30.61,67.72 v30.8,67.85 | C17.- 54.1,42.58 v54.61,42.77 | C30.2 v69.37,29.75 | v68.58,32.92 68.1,32.92 66.83,34.2 66.36,34.2 C26.2 | C28.2 v77.47,33.24 | v77.47,33.24 | 71.12,33.24 v71.44,32.92 71.12,33.24 C27.2 | IC2.1 66.04,27.84 | T5.E 39.05,12.29 v39.37,12.61 | C29.2 v62.23,42.13 62.55,41.81 IC1.15 | IC1.8 70.38,50.29 v70.48,50.39 | C31.2 v77.47,33.24 | C16.- 59.15,17.37 v59.05,17.46 | T7.E 85.56,49.68 v86.68,50.8 | IC6.1 IC6.2 6.99,57.78 6.35,58.42 v6.03,58.42 | D7.A 13.34,66.08 X5.1@2
  Bottom 0.406: v62.23,42.13 | v86.68,50.8 86.36,50.8
  pour Bottom: 0,78 95,78 95,0 37.5,0 37.5,21 33.34,21 33.34,43.09 37.5,43.09 37.5,50 0,50
GPIO4  (via drill 0.6)
  Top 0.406: v73.98,31.97 74.93,31.02 78.11,31.02 80.01,29.11 80.01,18.32 v78.42,16.73 | IC1.1 70.8,40.55 v71.75,39.59
  Bottom 0.406: v73.98,31.97 71.12,34.83 71.12,38.96 v71.75,39.59 | CON1.7 91.44,11.34 89.53,11.34 88.9,11.97 88.9,13.56 86.04,16.41 78.74,16.41 v78.42,16.73
GPIO05  (via drill 0.6)
  Top 0.406: R25.2 C28.1 v78.74,39.59 78.74,49.44 JP3.1
  Bottom 0.406: CON1.29 92.39,38.01 91.12,39.27 89.53,39.27 88.9,39.91 79.06,39.91 v78.74,39.59
GPIO06  (via drill 0.6)
  Top 0.406: JP3.3 76.2,49.44 76.2,42.13 v74.61,40.55 74.61,39.91 72.71,38.01 71.75,38.01 71.12,37.37 C27.1 R26.2
  Bottom 0.406: CON1.31 91.44,41.81 89.53,41.81 88.9,41.18 77.15,41.18 76.83,41.5 75.56,41.5 v74.61,40.55
GPIO12  (via drill 0.6)
  Top 0.406: R30.2 C31.1 v76.2,40.55 77.47,41.81 JP3.4
  Bottom 0.406: CON1.32 v76.2,40.55
GPIO13  (via drill 0.6)
  Top 0.406: R27.2 C26.1 66.36,36.41 68.58,38.64 72.39,38.64 73.66,39.91 v73.66,43.09 73.66,49.44 JP3.5
  Bottom 0.406: CON1.33 92.08,43.09 90.81,44.35 74.93,44.35 v73.66,43.09
GPIO17  (via drill 0.6)
  Top 0.406: R8.2 12.7,56.42 | T1.C 15.88,70.56 15.88,69.75 16.51,69.12 16.51,67.22 17.46,66.27 D4.1 16.51,65.17 v16.51,60.87 12.7,57.05 R8.2 | R8.2 | v30.48,52.93 35.56,52.93 39.05,49.44 39.05,22.77 41.27,20.54 41.27,18 45.4,13.88 73.03,13.88 76.2,17.05 76.2,18 v76.52,18.32
  Bottom 0.406: v16.51,60.87 27.62,60.87 29.84,58.64 29.84,53.56 v30.48,52.93 | v16.51,60.87 | v76.52,18.32 78.42,18.32 79.69,17.05 86.36,17.05 89.53,13.88 91.44,13.88 CON1.11
GPIO20
  Top 0.406: R29.1 87.09,45.09 CON1.38
GPIO22  (via drill 0.6)
  Top 0.406: D3.3 v26.67,59.59 | v29.21,51.98 35.24,51.98 38.42,48.8 38.42,22.45 40.64,20.23 40.64,17.68 45.09,13.24 73.34,13.24 76.83,16.73 76.83,17.37 77.47,18 v77.47,21.5
  Bottom 0.406: v26.67,59.59 27.94,59.59 29.21,58.33 v29.21,51.98 | CON1.15 91.44,21.5 v77.47,21.5
GPIO23  (via drill 0.6)
  Top 0.406: R14.1 75.25,11.34 83.5,19.59 v83.5,20.23
  Bottom 0.406: v83.5,20.23 84.14,20.86 89.53,20.86 CON1.16
GPIO24
  Top 0.406: CON2.18 53.98,3.71 53.98,5.94 54.93,6.89 77.47,6.89 88.27,17.68 88.27,20.86 CON1.18
GPIO25
  Top 0.406: CON1.22 89.22,27.84 86.36,24.99 86.36,18.64 76.52,8.79 50.8,8.79 48.9,6.89 48.9,3.71 CON2.22
GPIO26
  Top 0.406: CON1.37 91.44,46.9 91.44,37.37 90.81,36.73 87.31,36.73 85.09,34.51 R28.1
GPIO27
  Top 0.406: CON1.13 93.34,17.68 93.98,18.32 93.98,66.58 90.39,70.17 63.5,70.17 62.55,71.12 35.56,71.12 31.43,66.99 31.43,63.41 30.48,62.45 R9.1
LRCK  (via drill 0.6)
  Top 0.406: IC1.3 v72.07,43.09
  Bottom 0.406: CON1.35 91.44,46.9 89.53,46.9 88.9,46.26 88.9,45.62 88.27,44.99 73.98,44.99 v72.07,43.09
MISO
  Top 0.406: CON2.21 50.16,6.57 51.75,8.16 76.83,8.16 87,18.32 87,24.35 89.22,26.57 91.44,26.57 CON1.21
MOSI
  Top 0.406: CON2.19 52.7,6.25 53.98,7.53 77.15,7.53 87.63,18 87.63,22.77 88.9,24.04 91.44,24.04 CON1.19
N$1
  Top 0.406: IC4.23 59.05,30.39 60.64,31.97 C11.1 C12.1 | C12.1 R22.2 | C12.1 63.81,31.66 65.28,31.66 C13.+
N$2
  Top 0.406: IC4.28 57.78,36.73 60.17,39.12 62.23,39.12 62.87,39.59 67.63,39.59 68.26,40.23 68.26,40.86 69.22,41.81 IC1.2
N$3  (via drill 0.6)
  Top 0.406: IC4.27 59.05,35.47 59.69,36.1 59.69,37.37 60.8,38.48 63.02,38.48 63.82,37.69 66.04,37.69 v66.67,38.32 | v68.58,45.62 IC1.5
  Bottom 0.406: v66.67,38.32 66.67,44.35 67.94,45.62 v68.58,45.62
N$4
  Top 0.406: IC4.26 56.52,34.2 55.88,34.83 55.88,39.28 R15.1 57.79,40.23 58.42,40.86 58.42,43.09 58.74,43.4 62.87,43.4 63.18,43.09 IC1.14
N$5
  Top 0.406: IC4.9 46.35,26.57 45.72,25.94 45.72,22.77 44.77,21.5 43.13,21.5 IC5.1
N$6
  Top 0.406: IC2.5 73.72,21.75 R2.1
N$7
  Top 0.813: F1.1 7.62,33.56 13.34,27.84 13.34,25.16 IC3.6
N$8
  Top 0.406: R21.2 C18.1 C19.1 44.77,31.97 46.35,30.39 IC4.6 48.9,30.39 49.53,31.02 49.53,34.83 53.34,38.64 C17.+
N$9  (via drill 0.6)
  Top 0.406: C6.1 v80.96,64.13 v80.96,64.14
  Bottom 0.406: v80.96,64.14 80.96,67.27 OX2.1
N$10
  Top 0.406: C5.1 65.72,67.03 OX1.1
N$11
  Top 0.406: IC4.2 48.9,35.47 51.44,38.01 51.44,50.7 54.61,53.88 60.96,53.88 65.5,58.42 77.47,58.42 79.06,60.01 C6.2
N$12
  Top 0.406: IC4.1 48.9,36.73 50.8,38.64 50.8,51.02 54.29,54.52 60.64,54.52 63.18,57.05 63.18,60.23 C5.2
N$13
  Top 0.813: K1.P1 K1.O1 16.51,14.83 13.75,17.59 IC3.5 13.16,17.68 11.43,17.68 6.04,23.08 X1.2
N$14
  Top 0.406: R3.2 R4.1 T1.B
N$15  (via drill 0.6)
  Top 0.406: v17.78,53.24 R11.1
  Bottom 0.406: JP4.2 19.68,55.15 v17.78,53.24
N$16
  Top 0.406: D1.1 19.54,74.52 T2.C
N$17
  Top 0.406: D1.3 15.41,74.67 15.56,74.52 | 15.56,74.52 16.51,73.56 18.73,73.56 R4.2 | 15.56,74.52 12.8,71.76 11.34,71.76 X5.2
N$18
  Top 0.406: T2.E R6.2 R7.2 28.26,76.42 29.21,75.47 29.21,70.84 C9.+
N$19
  Top 0.406: T2.B 22.69,72.14 R5.2
N$20
  Top 0.406: 25.4,71.03 24.45,70.08 R5.1 22.86,68.33 D2.1 | 25.4,71.03 R6.1 | D3.1 23.81,60.55 24.13,60.87 25.4,60.87 26.67,62.13 26.67,69.75 25.4,71.03
N$21  (via drill 0.6)
  Top 0.406: D4.3 15.41,66.75 15.24,66.58 15.24,64.04 | 15.24,64.04 15.24,63.58 T3.C | T3.C 15.41,63.87 15.24,64.04 | T4.E 23.81,62.45 v24.45,61.82 | T3.C 15.41,61.97 v15.56,61.82
  Bottom 0.406: v24.45,61.82 v15.56,61.82
N$22
  Top 0.406: T3.E 17.61,64.21 17.78,64.04 19.05,64.04 20.32,62.77 R10.2
N$23
  Top 0.406: R12.2 15.55,56.42 17.78,56.42 R11.2 17.61,56.91 T3.B
N$24  (via drill 0.6)
  Top 0.406: T4.B 23.18,64.36 24.13,65.31 v24.77,65.31 | R9.2 29.53,64.67 v28.26,65.94
  Bottom 0.406: v24.77,65.31 27.62,65.31 v28.26,65.94
N$25
  Top 0.406: T4.C 25.4,63.41 26.04,64.04 26.04,66.58 25.4,67.22 D2.3
N$26
  Top 0.406: IC1.7 68.58,48.16 67.63,49.12 67.63,50.39 66.99,51.02 61.91,51.02 60.23,52.7 54.93,52.7 54.29,52.07 JP1.2
N$27
  Top 0.406: IC1.4 68.26,44.35 67.31,45.31 67.31,48.16 66.67,48.8 66.67,49.75 66.04,50.39 61.69,50.39 60.01,52.07 57.47,52.07 56.83,51.44 JP1.4
N$28
  Top 0.406: IC6.4 11.12,56.84 11.43,57.15 11.43,59.69 | 11.43,59.69 10.79,60.33 10.79,62.87 L3.1 | D7.C 11.57,59.84 11.43,59.69
N$29  (via drill 0.6)
  Top 0.406: R10.1 v20.32,58.33 R13.2 20.64,57.05 | JP2.2 78.74,18.32 77.47,17.05 77.47,16.41 73.66,12.61 44.77,12.61 40.01,17.37 40.01,19.91 37.78,22.13 37.78,48.16 34.92,51.02 27.94,51.02 v27.62,51.34
  Bottom 0.406: v27.62,51.34 26.67,52.29 26.67,57.05 25.4,58.33 v20.32,58.33
N$30
  Top 0.406: 43.81,34.83 C10.1 43.81,34.2 44.45,34.2 45.09,33.56 45.09,32.92 46.35,31.66 IC4.5
N$31
  Top 0.406: R18.2 60.65,23.08 59.69,24.04 IC4.18
N$32
  Top 0.406: R15.2 56.52,41.81 55.88,41.81 55.24,41.18 55.24,29.11 56.52,27.84 IC4.21 59.05,27.84 59.69,27.21 59.69,26.57 60.64,25.62 C14.1 C15.1 R20.1 63.81,22.77 64.14,22.77 64.77,22.13 64.77,18.32 64.14,17.68 63.82,17.68 C16.+
N$33
  Top 0.406: K1.16 29.21,6.89 31.75,9.43 32.85,9.43 D5.1 34.78,10.38 T5.C
N$34
  Top 0.406: T5.B 39.69,10.38 R14.2
N$35
  Top 0.406: R23.1 48.26,42.13 | 48.26,42.13 C22.1 | U$1.6 48.26,42.13
N$36
  Top 0.406: IC4.8 46.35,27.84 44.45,25.94 44.13,25.94 C20.1 43.81,23.72 R19.1
N$37
  Top 0.406: C21.1 41.27,23.72 R19.2
N$38
  Top 0.406: C22.2 49.53,38.64 48.9,38.01 46.99,38.01 45.72,36.73 45.72,35.15 46.67,34.2 IC4.3
N$39
  Top 0.406: C23.2 44.45,38.64 45.09,38.01 45.09,34.51 46.67,32.92 IC4.4
N$40
  Top 0.406: C23.1 R24.1 40.32,43.72 40.32,50.7 34.61,56.42 U$2.6
N$41
  Top 0.406: U$1.1 60.01,56.42 C24.2
N$42  (2 unrouted)
  Top 0.406: X3.1@2 60.5,65.58 58.42,63.5 U$1.3
N$43
  Top 0.406: X3.2 55,61.84 57.47,59.37 60.86,59.37 C24.1
N$44
  Top 0.406: U$2.1 44.77,56.42 C25.2
N$45  (2 unrouted)
  Top 0.406: X4.1@2 46.1,66.42 43.18,63.5 U$2.3
N$46
  Top 0.406: X4.2 41,60.92 42.55,59.37 45.62,59.37 C25.1
N$47
  Top 0.406: T6.B 83.65,36.59 R28.2
N$48
  Top 0.813: X2.1 6.27,8.08 10.16,11.97 K1.S1
N$49
  Bottom 0.813: X2.2 X1.1 6.11,18.08 8.89,20.86 8.89,25.94 6.35,28.48 F1.2
N$50  (via drill 0.6)
  Top 0.406: C2.1 L1.2 71.25,63.95 v71.44,64.14
  Bottom 0.406: v71.44,64.14 71.44,67.33 OX1.3
N$51
  Top 0.406: OX2.3 86.27,62.35 L2.2 C1.1
N$52
  Top 0.406: T7.C 82.87,48.26 81.92,49.21 81.92,52.07 82.87,53.02 D6.1 83.19,53.19 83.19,54.93 82.55,55.56 JP5.1
N$53
  Top 0.406: IC1.12 61.69,45.62 60.96,46.35 60.96,50.16 60.33,50.8 59.47,50.8 JP1.6
N$54
  Top 0.406: JP3.2 80.01,40.72 T6.C
N$55
  Top 0.406: R29.2 83.5,46.04 84.45,46.99 85.23,46.99 T7.B
PWM  (via drill 0.6)
  Top 0.406: IC2.2 66.67,26.57 65.41,25.3 65.41,23.4 67.31,21.5 R1.1 | 67.31,21.18 R1.1 | R1.1 | v65.72,16.73 65.72,19.59 R1.1
  Bottom 0.406: v65.72,16.73 65.72,7.84 64.14,6.25 64.14,3.71 CON2.12
SCL  (via drill 0.6)
  Top 0.406: 75.56,25.3 IC2.6 | R17.1 54.3,19.91 v55.24,20.86 55.88,21.5 IC4.16 | 75.56,25.3 75.56,20.86 74.3,19.59 v70.17,19.59 | JP2.6 78.11,27.84 75.56,25.3
  Bottom 0.406: v55.24,20.86 64.14,20.86 65.41,19.59 v70.17,19.59 79.69,10.06 85.72,10.06 87,8.79 91.12,8.79 92.39,7.53 CON1.5
SDA  (via drill 0.6)
  Top 0.406: v69.22,18.64 74.3,18.64 76.2,20.54 76.2,24.04 77.47,25.3 JP2.4 | R16.1 51.75,18.95 v53.5,20.7 55.56,22.77 IC4.17 | v75.56,26.57 IC2.7
  Bottom 0.406: v53.5,20.7 54.29,19.91 55.56,19.91 55.88,20.23 63.82,20.23 65.09,18.95 68.58,18.95 68.9,18.64 v69.22,18.64 70.17,18.64 79.38,9.43 85.41,9.43 88.58,6.25 90.81,6.25 92.08,4.99 CON1.3 | JP2.4 76.83,25.3 v75.56,26.57

### Text on the board
Bottom: RaspiDAC | V2.0 | JP2016
tPlace: 1 | 1 | 1